# Altium schematic sheet Microcontroller.SchDoc
size A3; ApprovedBy: Betül Demirhan; CheckedBy: UDEMY; DrawnBy: Furkan Demirhan; Revision: AA; SheetNumber: 4; SheetTotal: 5; ProjectDescription: Microcontroller of Wireless Security Detector; ReleaseDate: 21.11.2024
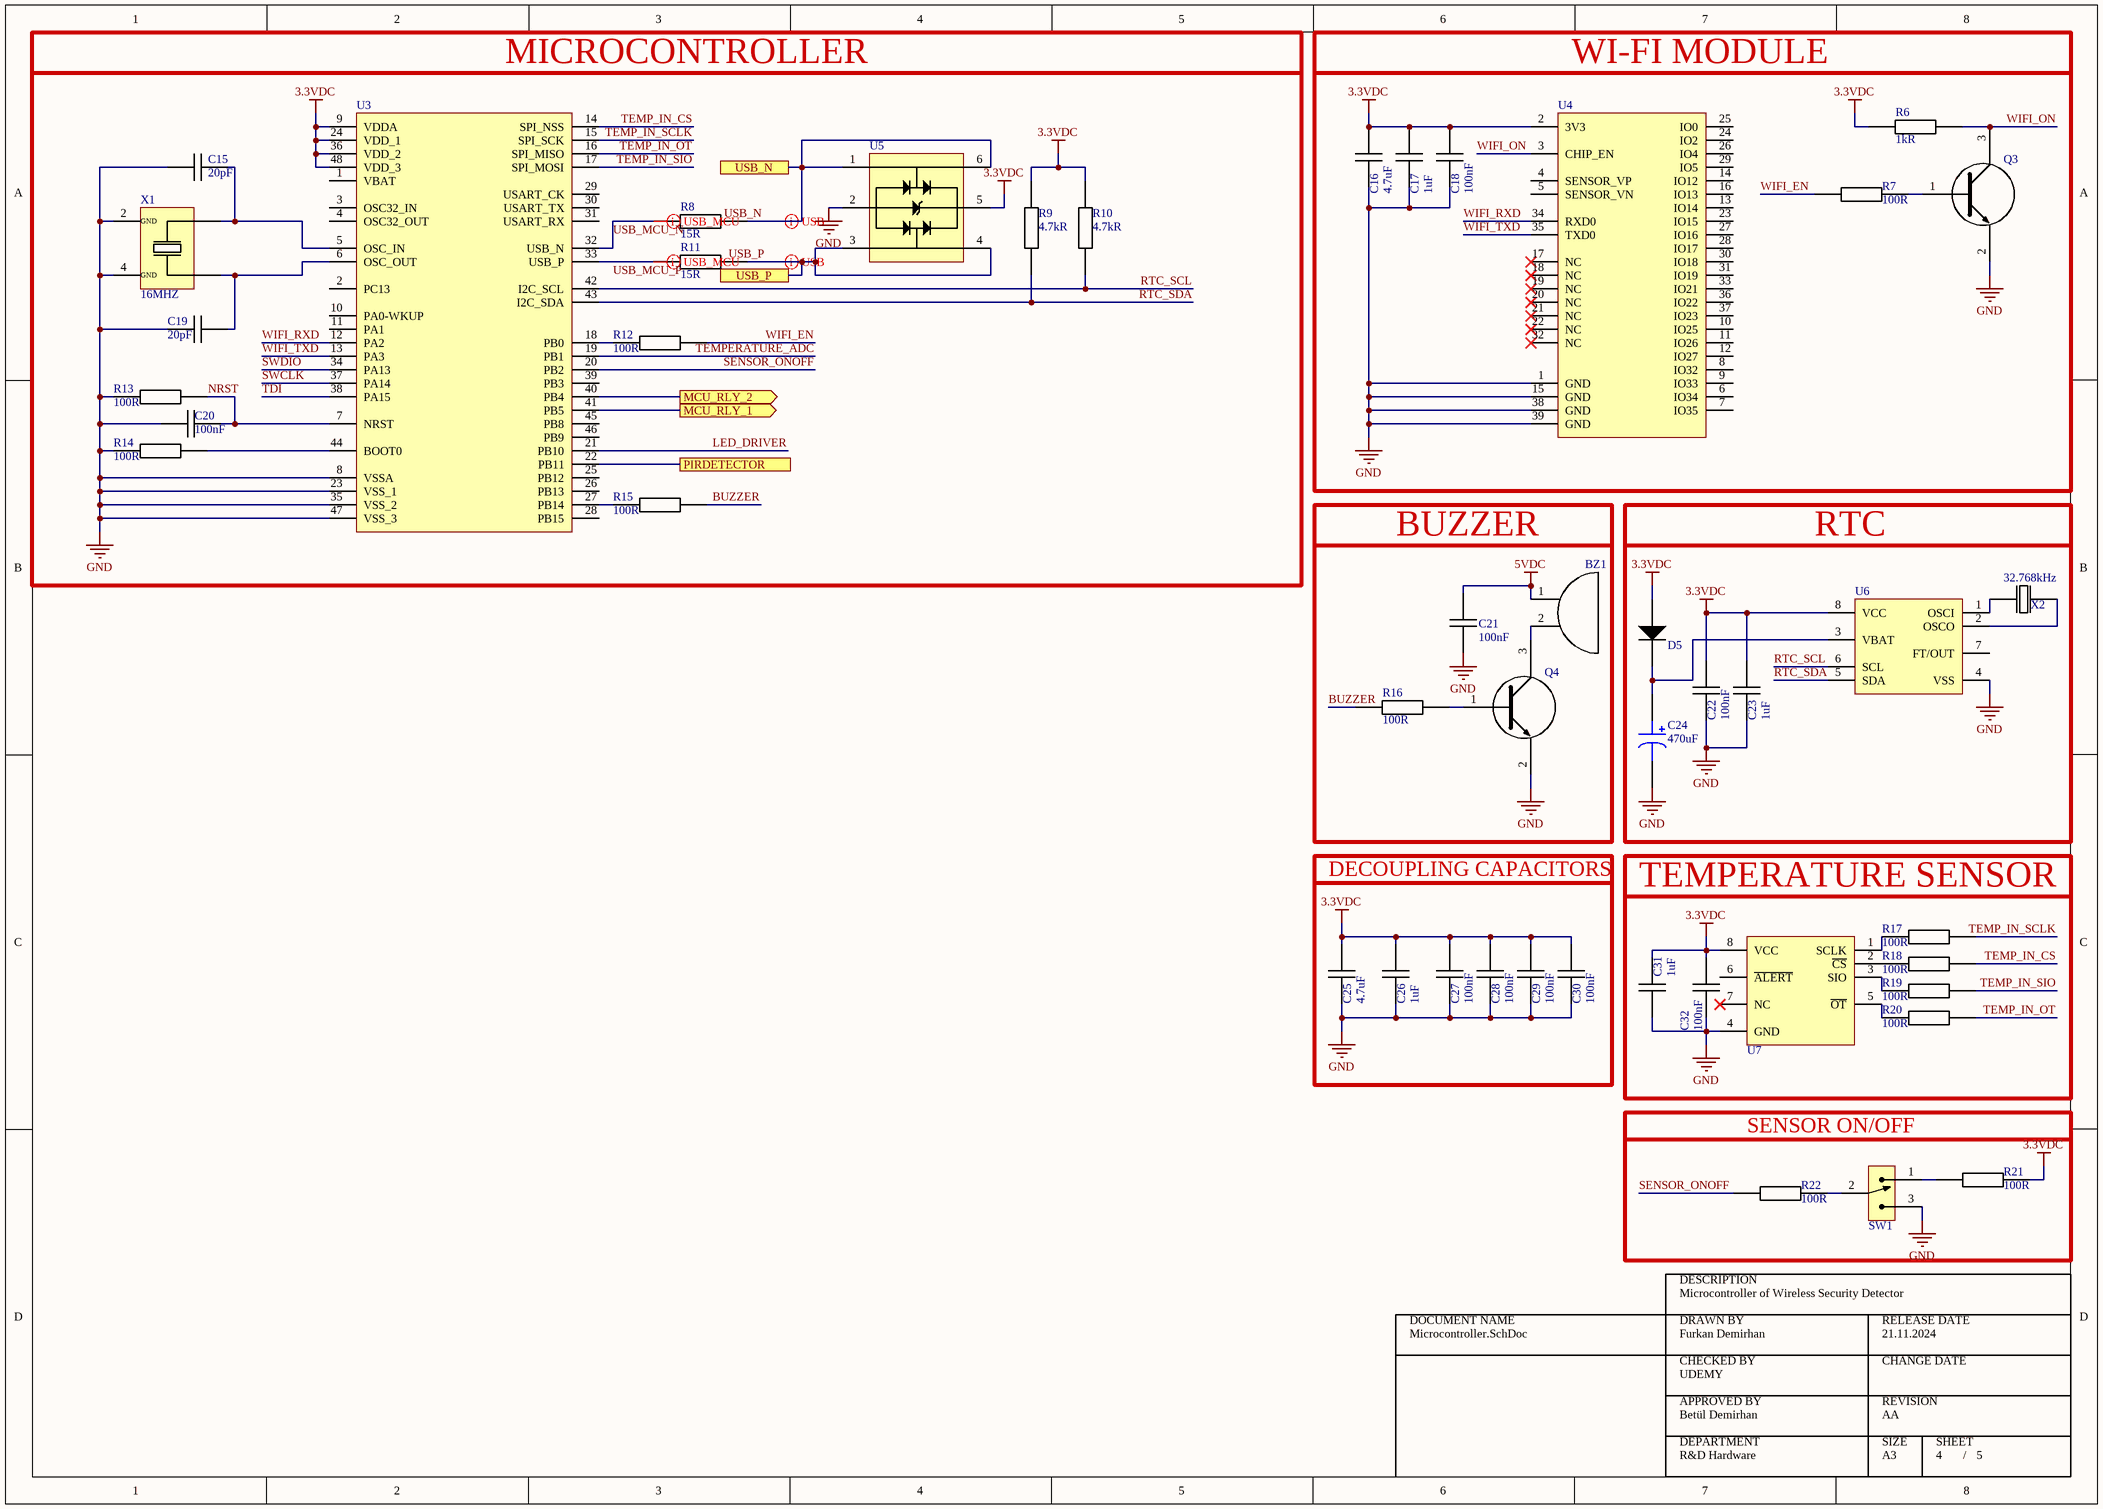
[diagram p0: Microcontroller.SchDoc]

## Parts
BZ1  CMI-9605IC-0580T  [CMI-9605IC-0580T]  (value not drawn)
C15  value 20pF  [CAP_0603]  (hidden comment: CL10C200JB8NNNC)
C16  value 4.7uF  [CAP_0805]  (hidden comment: CL21A475KAQNNNE)
C17  value 1uF  [CAP_0805]  (hidden comment: CL21B105KBFNNNE)
C18  value 100nF  [CAP_0805]  (hidden comment: CL21B104KBCNNNC)
C19  value 20pF  [CAP_0603]  (hidden comment: CL10C200JB8NNNC)
C20  value 100nF  [CAP_0805]  (hidden comment: CL21B104KBCNNNC)
C21  value 100nF  [CAP_0805]  (hidden comment: CL21B104KBCNNNC)
C22  value 100nF  [CAP_0805]  (hidden comment: CL21B104KBCNNNC)
C23  value 1uF  [CAP_0805]  (hidden comment: CL21B105KBFNNNE)
C24  Capacitance: 470uF  [CAP_RADIAL_R10_P5]  (hidden comment: ESH477M050AH4AA)
C25  value 4.7uF  [CAP_0805]  (hidden comment: CL21A475KAQNNNE)
C26  value 1uF  [CAP_0805]  (hidden comment: CL21B105KBFNNNE)
C27  value 100nF  [CAP_0805]  (hidden comment: CL21B104KBCNNNC)
C28  value 100nF  [CAP_0805]  (hidden comment: CL21B104KBCNNNC)
C29  value 100nF  [CAP_0805]  (hidden comment: CL21B104KBCNNNC)
C30  value 100nF  [CAP_0805]  (hidden comment: CL21B104KBCNNNC)
C31  value 1uF  [CAP_0805]  (hidden comment: CL21B105KBFNNNE)
C32  value 100nF  [CAP_0805]  (hidden comment: CL21B104KBCNNNC)
D5  1N4148WS  [SOD323F]  (value not drawn)
Q3  MMBT3904-7-F  [SOT23F]  (value not drawn)
Q4  MMBT3904-7-F  [SOT23F]  (value not drawn)
R6  value 1kR  [RES_0603]  (hidden comment: RC0603FR-071KL)
R7  value 100R  [RES_0603]  (hidden comment: RC0603FR-07100RL)
R8  value 15R  [RES_0603]  (hidden comment: RC0603JR-0715RL)
R9  value 4.7kR  [RES_0603]  (hidden comment: RC0603JR-074K7L)
R10  value 4.7kR  [RES_0603]  (hidden comment: RC0603JR-074K7L)
R11  value 15R  [RES_0603]  (hidden comment: RC0603JR-0715RL)
R12  value 100R  [RES_0603]  (hidden comment: RC0603FR-07100RL)
R13  value 100R  [RES_0603]  (hidden comment: RC0603FR-07100RL)
R14  value 100R  [RES_0603]  (hidden comment: RC0603FR-07100RL)
R15  value 100R  [RES_0603]  (hidden comment: RC0603FR-07100RL)
R16  value 100R  [RES_0603]  (hidden comment: RC0603FR-07100RL)
R17  value 100R  [RES_0603]  (hidden comment: RC0603FR-07100RL)
R18  value 100R  [RES_0603]  (hidden comment: RC0603FR-07100RL)
R19  value 100R  [RES_0603]  (hidden comment: RC0603FR-07100RL)
R20  value 100R  [RES_0603]  (hidden comment: RC0603FR-07100RL)
R21  value 100R  [RES_0603]  (hidden comment: RC0603FR-07100RL)
R22  value 100R  [RES_0603]  (hidden comment: RC0603FR-07100RL)
SW1  EG1215AA  [EG1215AA]  (value not drawn)
U3  STM32F103C6T6A  [LQFP48]  (value not drawn)
U4  ESP32-WROOM-32E-N4  [ESP32-WROOM-32E-N4]  (value not drawn)
U5  USBLC6-2SC6  [SOT23-6L]  (value not drawn)
U6  M41T00M6F  [SOIC8]  (value not drawn)
U7  MAX6662MSA+  [SOIC8]  (value not drawn)
X1  Frequency: 16MHZ  [ECS]  (hidden comment: ECS-160-20-30B-TR)
X2  Frequency: 32.768kHz  [ABS05]  (hidden comment: ABS05-32.768KHZ-T)

## Ports
MCU_RLY_1 (out, see Power Management[6A]), MCU_RLY_2 (out, see Power Management[6B]), PIRDETECTOR (see Power Management[3B]), USB_N (see Power Management[5B]), USB_P (see Power Management[5B])

## Nets
3.3VDC: C16.1 C17.1 C18.1 C22.2 C23.2 C25.2 C26.2 C27.2 C28.2 C29.2 C30.2 C31.2 C32.2 D5.2 R6.1 R9.2 R10.2 R21.2 U3.9(VDDA) U3.24(VDD_1) U3.36(VDD_2) U3.48(VDD_3) U4.2(3V3) U5.5(VBUS) U6.8(VCC) U7.8(VCC)
5VDC: BZ1.1 C21.2
GND: C15.1 C16.2 C17.2 C18.2 C19.1 C20.2 C21.1 C22.1 C23.1 C24.2 C25.1 C26.1 C27.1 C28.1 C29.1 C30.1 C31.1 C32.1 Q3.2(E) Q4.2(E) R13.1 R14.1 SW1.3 U3.8(VSSA) U3.23(VSS_1) U3.35(VSS_2) U3.47(VSS_3) U4.1(GND) U4.15(GND) U4.38(GND) U4.39(GND) U5.2(GND) U6.4(VSS) U7.4(GND) X1.2(GND) X1.4(GND)
BUZZER: R15.2 R16.1
LED_DRIVER: U3.21(PB10)
MCU_RLY_1: U3.41(PB5) ; port MCU_RLY_1
MCU_RLY_2: U3.40(PB4) ; port MCU_RLY_2
NRST: C20.1 R13.2 U3.7(NRST)
PIRDETECTOR: U3.22(PB11) ; port PIRDETECTOR
RTC_SCL: R10.1 U3.42(I2C_SCL) U6.6(SCL)
RTC_SDA: R9.1 U3.43(I2C_SDA) U6.5(SDA)
SENSOR_ONOFF: R22.1 U3.20(PB2)
SWCLK: U3.37(PA14)
SWDIO: U3.34(PA13)
TDI: U3.38(PA15)
TEMP_IN_CS: R18.2 U3.14(SPI_NSS)
TEMP_IN_OT: R20.2 U3.16(SPI_MISO)
TEMP_IN_SCLK: R17.2 U3.15(SPI_SCK)
TEMP_IN_SIO: R19.2 U3.17(SPI_MOSI)
TEMPERATURE_ADC: U3.19(PB1)
USB_MCU_N: R8.1 U3.32(USB_N)
USB_MCU_P: R11.1 U3.33(USB_P)
USB_N: R8.2 U5.1(I/O1) U5.6(I/O1) ; port USB_N
USB_P: R11.2 U5.3(I/O2) U5.4(I/O2) ; port USB_P
WIFI_EN: R7.1 R12.2
WIFI_ON: Q3.3(C) R6.2 U4.3(CHIP_EN)
WIFI_RXD: U3.12(PA2) U4.34(RXD0)
WIFI_TXD: U3.13(PA3) U4.35(TXD0)
NetBZ1_2: BZ1.2 Q4.3(C)
NetC15_2: C15.2 U3.5(OSC_IN) X1.1
NetC19_2: C19.2 U3.6(OSC_OUT) X1.3
NetC24_1: C24.1 D5.1 U6.3(VBAT)
NetQ3_1: Q3.1(B) R7.2
NetQ4_1: Q4.1(B) R16.2
NetR12_1: R12.1 U3.18(PB0)
NetR14_2: R14.2 U3.44(BOOT0)
NetR15_1: R15.1 U3.27(PB14)
NetR17_1: R17.1 U7.1(SCLK)
NetR18_1: R18.1 U7.2(~{CS})
NetR19_1: R19.1 U7.3(SIO)
NetR20_1: R20.1 U7.5(~{OT})
NetR21_1: R21.1 SW1.1
NetR22_2: R22.2 SW1.2
NetU6_1: U6.1(OSCI) X2.1
NetU6_2: U6.2(OSCO) X2.2

Not connected (* = marked no-connect by the designer): U3 1(VBAT) 2(PC13) 3(OSC32_IN) 4(OSC32_OUT) 10(PA0-WKUP) 11(PA1) 25(PB12) 26(PB13) 28(PB15) 29(USART_CK) 30(USART_TX) 31(USART_RX) 39(PB3) 45(PB8) 46(PB9); U4 4(SENSOR_VP) 5(SENSOR_VN) 6(IO34) 7(IO35) 8(IO32) 9(IO33) 10(IO25) 11(IO26) 12(IO27) 13(IO14) 14(IO12) 16(IO13) 17(NC)* 18(NC)* 19(NC)* 20(NC)* 21(NC)* 22(NC)* 23(IO15) 24(IO2) 25(IO0) 26(IO4) 27(IO16) 28(IO17) 29(IO5) 30(IO18) 31(IO19) 32(NC)* 33(IO21) 36(IO22) 37(IO23); U6 7(FT/OUT); U7 6(~{ALERT}) 7(NC)*

## Layout directives
differential pair: USB_MCU_N, USB_MCU_P, USB_N, USB_P

## Notes on the sheet
- MICROCONTROLLER
- WI-FI MODULE
- BUZZER
- RTC
- DECOUPLING CAPACITORS
- TEMPERATURE SENSOR
- SENSOR ON/OFF
- DOCUMENT NAME
- DESCRIPTION
- DRAWN BY
- RELEASE DATE
- CHECKED BY
- CHANGE DATE
- APPROVED BY
- DEPARTMENT
- R&D Hardware
- SIZE
- A3
- REVISION
- SHEET
- /

## Library data of the parts
BZ1 = CMI-9605IC-0580T: Audio Buzzer Magnetic 3VDC 7VDC 30mA 5VDC 85dB 2600Hz to 2800Hz Through Hole Pin Box; Manufacturer: CUI Devices; Designed by: FURKAN; Shape: 4456Shape; Supplier: Digikey; Supplier Part Number: 2223-CMI-9605IC-0580T-ND; Manufacturer Part Number: CMI-9605IC-0580T; RoHS: No; Category: Audio Products; Stock: 4371; Pricing: 1=1,15, 10=0,937, 25=0,8636, 50=0,8122, 150=0,737, 300=0,73127 (USD); Length: 9.6mm; Width: 9.6mm; Height: 5mm; Case/Package: CMI-9605IC-0580T
C15 C19 = CAP CER 20pF 0603: CAP CER 20pF ±5% 0603 SMD; Manufacturer: Samsung; Designed by: FURKAN; Voltage Rating (DC): 50V; Supplier: Digikey; Supplier Part Number: 1276-1187-1-ND; Manufacturer Part Number: CL10C200JB8NNNC; RoHS: Yes; Category: Ceramic Capacitors; Stock: 252087; Pricing: 1=0,1, 10=0,035, 50=0,0236, 100=0,0201, 500=0,01432, 1000=0,01254 (USD); ComponentLink1URL: https://datasheet.ciiva.com/26877/getdatasheetpartid-640634-26877974.pdf?src-supplier=Verical; ComponentLink1Description: https://datasheet.ciiva.com/26877/getdatasheetpartid-640634-26877974.pdf?src-supplier=Verical; ComponentLink2URL: https://datasheet.ciiva.com/26310/mlcc-catalogdownload2013-eng-26310315.pdf?src-supplier=Distrelec; ComponentLink2Description: https://datasheet.ciiva.com/26310/mlcc-catalogdownload2013-eng-26310315.pdf?src-supplier=Distrelec; Case/Package: 0603
C16 C25 = CAP CER 4.7uF 0805: Multilayer Ceramic Capacitor, 4.7 uF, 25 V, ± 10%, X5R, 0805 [2012 Metric]; Manufacturer: Samsung; Designed by: FURKAN; Voltage Rating: 25V; ComponentLink1URL: https://datasheet.ciiva.com/25798/cl21a475kaqnnne-25798882.pdf?src-supplier=Digikey; ComponentLink1Description: https://datasheet.ciiva.com/25798/cl21a475kaqnnne-25798882.pdf?src-supplier=Digikey; Supplier: Digikey; Supplier Part Number: 1276-1244-1-ND; Manufacturer Part Number: CL21A475KAQNNNE; RoHS: Yes; Category: Ceramic Capacitors; Stock: 2972760; Pricing: 1=0,1, 10=0,057, 50=0,0394, 100=0,0339, 500=0,02466, 1000=0,02177 (USD); Mounting Technology: Surface Mount; Case/Package: 0805; Case Code (Metric): 2012; Case Code (Imperial): 0805; Material: Ceramic; Min Operating Temperature: -55°C; Max Operating Temperature: 85°C; Packaging: Tape and Reel; Tolerance: 10%; Dielectric: X5R; Voltage Rating (DC): 25V; Series: CL; Construction: Flat; Length: 2mm; Height: 1.25mm; Depth: 1.25mm; Radiation Hardening: No; Lead Free: Lead Free; RoHS Compliant: Yes
C17 C23 C26 C31 = CAP CER 1uF 0805: Multilayer Ceramic Capacitor, 1 uF, 50 V, 10%, X7R, 0805 [2012 Metric]; Manufacturer: Samsung; Voltage Rating: 50V; Designed by: FURKAN; Supplier: Digikey; Supplier Part Number: 1276-1029-1-ND; Manufacturer Part Number: CL21B105KBFNNNE; RoHS: Yes; Category: Ceramic Capacitors; Stock: 845645; Pricing: 1=0,11, 10=0,061, 50=0,042, 100=0,0361, 500=0,02632, 1000=0,02327, 2000=0,02075, 4000=0,01867, 6000=0,01762, 10000=0,01646, 14000=0,01578, 20000=0,01512, 50000=0,0137, 100000=0,01283, 200000=0,01212 (USD); Mounting Technology: Surface Mount; Case/Package: 0805; Case Code (Metric): 2012; Case Code (Imperial): 0805; Material: Ceramic; Min Operating Temperature: -55°C; Max Operating Temperature: 125°C; Tolerance: 10%; Packaging: Tape and Reel; Package Quantity: 1; Dielectric: X7R; Voltage: 50V; Series: CL; Construction: Flat; Voltage Rating (DC): 50V; Length: 2mm; Width: 0.049inch; Height: 1.25mm; Thickness: 0.053inch; Depth: 1.25mm; Radiation Hardening: No; RoHS Compliant: Yes; ComponentLink1URL: https://datasheet.ciiva.com/25800/cl21b105kbfnnne-25800291.pdf?src-supplier=Digikey; ComponentLink1Description: https://datasheet.ciiva.com/25800/cl21b105kbfnnne-25800291.pdf?src-supplier=Digikey; ComponentLink2URL: https://datasheet.ciiva.com/16449/cl21b105kbfnnne-16449003.pdf?src-supplier=Future+Electronics; ComponentLink2Description: https://datasheet.ciiva.com/16449/cl21b105kbfnnne-16449003.pdf?src-supplier=Future+Electronics; ComponentLink3URL: https://datasheet.ciiva.com/26838/getdatasheetpartid-354075-26838668.pdf?src-supplier=Verical; ComponentLink3Description: https://datasheet.ciiva.com/26838/getdatasheetpartid-354075-26838668.pdf?src-supplier=Verical
C18 C20-C22 C27-C30 C32 = CAP CER 100nF 0805: CAP CER 100 nF 10% 50 V 0805 SMD; Manufacturer: Samsung; Designed by: FURKAN; Material: Ceramic; Dielectric: X7R; Voltage Rating: 50V; Supplier: Digikey; Supplier Part Number: 1276-1003-1-ND; Manufacturer Part Number: CL21B104KBCNNNC; RoHS: Yes; Category: Ceramic Capacitors; Stock: 2055733; Pricing: 1=0,1, 10=0,035, 50=0,0238, 100=0,0203, 500=0,01446, 1000=0,01266, 4000=0,00995, 8000=0,00893, 12000=0,00842, 20000=0,00785, 28000=0,00752, 40000=0,0072, 100000=0,00651, 200000=0,00609, 400000=0,00574 (USD); Mounting Technology: Surface Mount; Case/Package: 0805; Case Code (Metric): 2012; Case Code (Imperial): 0805; Min Operating Temperature: -55°C; Max Operating Temperature: 125°C; Tolerance: 10%; Packaging: Tape and Reel; Voltage: 50V; Series: CL; Construction: Flat; Voltage Rating (DC): 50V; Length: 2mm; Width: 0.049inch; Height: 0.85mm; Depth: 1.25mm; Thickness: 0.037inch; Radiation Hardening: No; RoHS Compliant: Yes; Lead Free: 5697LeadFree; ComponentLink1URL: https://datasheet.ciiva.com/25710/cl21b104kbcnnnc-25710182.pdf?src-supplier=Digikey; ComponentLink1Description: https://datasheet.ciiva.com/25710/cl21b104kbcnnnc-25710182.pdf?src-supplier=Digikey; ComponentLink2URL: https://datasheet.ciiva.com/29199/454152-da-01-en-vs-kondensator-0805-29199814.pdf?src-supplier=Conrad; ComponentLink2Description: https://datasheet.ciiva.com/29199/454152-da-01-en-vs-kondensator-0805-29199814.pdf?src-supplier=Conrad
C24 = CAP ALU ELEC 470uF: Electrolytic capacitor, 470 µF, 50 V (DC), ±20 %, radial, pitch 5 mm, Ø 13 mm; Manufacturer: KEMET; Designed by: FURKAN; Voltage Rating (DC): 50V; Category: LDO; Diameter: 10mm; Height: 20mm; Manufacturer Part Number: ESH477M050AH4AA; Supplier: Digikey; Supplier Part Number: 399-15683-ND; RoHS: Yes; Stock: 39; Pricing: 1=0,69, 10=0,417, 50=0,3084, 200=0,2466, 600=0,21183, 1000=0,1989, 2600=0,17907, 5000=0,16818 (USD); ComponentLink1URL: https://api.kemet.com/component-edge/download/datasheet/ESH477M050AH4AA.pdf?src-supplier=Digikey; ComponentLink1Description: https://api.kemet.com/component-edge/download/datasheet/ESH477M050AH4AA.pdf?src-supplier=Digikey; ComponentLink2URL: https://datasheet.octopart.com/ESH477M050AH4AA-KEMET-datasheet-130075338.pdf?src-supplier=Newark; ComponentLink2Description: https://datasheet.octopart.com/ESH477M050AH4AA-KEMET-datasheet-130075338.pdf?src-supplier=Newark; Case/Package: CAP_RADIAL_R10_P5
D5 = 1N4148WS: Diode Ultra Fast Recovery Rectifier 75V 0.15A 2-Pin SOD-323F T/R; Manufacturer: ON Semiconductor / Fairchild; Designed by: FURKAN; Max Reverse Current: 5uA; Max Forward Surge Current (Ifsm): 2A; Forward Current: 150mA; Reverse Recovery Time: 4ns; Element Configuration: Single; Value: 4pF; Supplier: Digikey; Supplier Part Number: 1N4148WSFSCT-ND; Manufacturer Part Number: 1N4148WS; RoHS: Yes; Category: Rectifier Diodes; Stock: 255722; Pricing: 1=0,11, 10=0,076, 100=0,051, 500=0,0387, 1000=0,0345, 3000=0,02897, 6000=0,02611, 9000=0,02463, 15000=0,02296, 21000=0,02195, 30000=0,02097, 75000=0,0188, 150000=0,01745, 300000=0,0165 (USD); Mounting Technology: Surface Mount; Pins: 2; Weight: 0.0276g; Min Operating Temperature: -55°C; Max Operating Temperature: 150°C; Average Rectified Current: 150mA; Max Repetitive Reverse Voltage (Vrrm): 75V; Reverse Voltage: 75V; Max Reverse Voltage (DC): 75V; Series: -; Packaging: Tape and Reel; Package Quantity: 1; Recovery Time: 4ns; Length: 1.8mm; Width: 1.35mm; Height: 1mm; Radiation Hardening: No; RoHS Compliant: Yes; Reach SVHC Compliant: No; Lead Free: 5697LeadFree; ComponentLink1URL: https://datasheet.ciiva.com/15208/getdatasheetpartid-127819-15208358.pdf?src-supplier=Verical; ComponentLink1Description: https://datasheet.ciiva.com/15208/getdatasheetpartid-127819-15208358.pdf?src-supplier=Verical; ComponentLink2URL: https://datasheet.ciiva.com/8300/1n914bws-8300360.pdf?src-supplier=Avnet; ComponentLink2Description: https://datasheet.ciiva.com/8300/1n914bws-8300360.pdf?src-supplier=Avnet; ComponentLink3URL: https://datasheet.ciiva.com/910/1n4148ws-910381.pdf?src-supplier=Digikey; ComponentLink3Description: https://datasheet.ciiva.com/910/1n4148ws-910381.pdf?src-supplier=Digikey; Case/Package: SOD323F
Q3 Q4 = MMBT3904-7-F: Transistor General Purpose BJT NPN 40 Volt 0.2A Automotive 3-Pin SOT-23; Manufacturer: Diodes Zetex; Designed by: FURKAN; Max Power Dissipation: 300mW; Collector Emitter Voltage (VCEO): 40V; Max Collector Current: 200mA; Collector Base Voltage (VCBO): 60V; Power Dissipation: 350mW; Frequency: 300MHz; hFE Min: 100; Number of Elements: 1; Emitter Base Voltage (VEBO): 6V; Collector Emitter Saturation Voltage: 300mV; Supplier: Digikey; Supplier Part Number: MMBT3904-FDICT-ND; Manufacturer Part Number: MMBT3904-7-F; RoHS: Yes; Category: BJTs; Stock: 3904155; Pricing: 1=0,1, 10=0,054, 100=0,0361, 500=0,0273, 1000=0,02428, 3000=0,02028, 6000=0,0182, 9000=0,01712, 15000=0,01589, 21000=0,01516, 30000=0,01444, 75000=0,01285, 150000=0,01185, 300000=0,01101 (USD); Mounting Technology: Surface Mount; Case/Package: SOT-23; Pins: 3; Weight: 0.000282oz; Min Operating Temperature: -55°C; Max Operating Temperature: 150°C; Polarity: NPN; Packaging: Tape and Reel; Voltage Rating (DC): 40V; Package Quantity: 3000; Transition Frequency: 300MHz; Collector Emitter Breakdown Voltage: 40V; Max Breakdown Voltage: 40V; Continuous Collector Current: 200mA; Clock Frequency: 300MHz; Gain Bandwidth Product: 300MHz; Series: Automotive, AEC-Q101; Collector-emitter Voltage-Max: 300mV; Length: 3.05mm; Width: 1.4mm; Height: 1mm; Radiation Hardening: No; Reach SVHC Compliant: No; Lead Free: Lead Free; RoHS Compliant: Yes; ComponentLink1URL: https://datasheet.ciiva.com/11201/ds30036-11201778.pdf?src-supplier=Avnet; ComponentLink1Description: https://datasheet.ciiva.com/11201/ds30036-11201778.pdf?src-supplier=Avnet; ComponentLink2URL: https://datasheet.ciiva.com/15138/getdatasheetpartid-53265-15138780.pdf?src-supplier=Verical; ComponentLink2Description: https://datasheet.ciiva.com/15138/getdatasheetpartid-53265-15138780.pdf?src-supplier=Verical; ComponentLink3URL: https://datasheet.ciiva.com/22711/1915516-22711750.pdf?src-supplier=Element14; ComponentLink3Description: https://datasheet.ciiva.com/22711/1915516-22711750.pdf?src-supplier=Element14; ComponentLink4URL: https://datasheet.ciiva.com/11198/ds30036-11198999.pdf?src-supplier=Avnet; ComponentLink4Description: https://datasheet.ciiva.com/11198/ds30036-11198999.pdf?src-supplier=Avnet; ComponentLink5URL: https://datasheet.ciiva.com/6361/ds30036-6361256.pdf?src-supplier=Digikey; ComponentLink5Description: https://datasheet.ciiva.com/6361/ds30036-6361256.pdf?src-supplier=Digikey; ComponentLink6URL: https://datasheet.ciiva.com/6361/ds30036-6361254.pdf?src-supplier=Digikey; ComponentLink6Description: https://datasheet.ciiva.com/6361/ds30036-6361254.pdf?src-supplier=Digikey
R6 = RES 1K OHM 0603: RES 1K OHM 1% 0603 SMD; Manufacturer: Yageo; Designed by: FURKAN; Temperature Coefficient: 100ppm/°C; Power Rating: 100mW; Voltage Rating: 50V; Supplier: Digikey; Supplier Part Number: 311-1.00KHRCT-ND; Manufacturer Part Number: RC0603FR-071KL; RoHS: Yes; Category: Chip SMD Resistors; Stock: 6043157; Pricing: 1=0,1, 10=0,012, 50=0,0096, 100=0,0071, 500=0,00612, 1000=0,0051, 5000=0,0051, 10000=0,00221, 15000=0,00204, 25000=0,0019 (USD); Case/Package: 0603; Contact Plating: Tin,Matte; Case Code (Imperial): 0603; Case Code (Metric): 1608; Min Operating Temperature: -55°C; Max Operating Temperature: 155°C; Tolerance: 1%; Resistor Type: Thick Film; Packaging: Tape and Reel; Termination: SMD/SMT; Features: Moisture Resistant; Series: RC; Max Power Dissipation: 100mW; Number of Terminations: 2; Technology: THICK FILM; Resistance Tolerance: 1%; Construction: Rectangular; Length: 1.6mm; Height: 0.45mm; Depth: 0.8mm; Reach SVHC Compliant: No; Lead Free: 5697LeadFree; Military Standard: Not; RoHS Compliant: Yes
R7 R12-R22 = RES 100 OHM 0603: RES 100 OHM 1% 0603 SMD; Manufacturer: Yageo; Designed by: FURKAN; Temperature Coefficient: 100ppm/°C; Voltage Rating (DC): 50V; Power Rating: 100mW; Supplier: Digikey; Supplier Part Number: 311-100HRCT-ND; Manufacturer Part Number: RC0603FR-07100RL; RoHS: Yes; Category: Chip SMD Resistors; Stock: 1340836; Pricing: 1=0,1, 10=0,012, 50=0,0096, 100=0,0071, 500=0,00612, 1000=0,0051 (USD); Case/Package: 0603; Pins: 2; Case Code (Imperial): 0603; Case Code (Metric): 1608; Min Operating Temperature: -55°C; Max Operating Temperature: 155°C; Tolerance: 1%; Resistor Type: Thick Film; Packaging: Tape and Reel; Voltage Rating: 50V; Termination: SMD/SMT; Features: Moisture Resistant; Series: RC; Max Power Dissipation: 100mW; Number of Terminations: 2; Construction: Rectangular; Resistance Tolerance: 1%; Technology: THICK FILM; Length: 1.6mm; Width: 0.8mm; Height: 0.45mm; Depth: 0.8mm; Lead Free: Lead Free; Reach SVHC Compliant: Unknown; RoHS Compliant: Yes; Military Standard: Not
R8 R11 = RES 15 OHM 0603: RES 15 OHM 5% 0603 SMD; Manufacturer: Yageo; Designed by: FURKAN; Voltage Rating (AC): 50V; Supplier: Digikey; Supplier Part Number: 311-15GRCT-ND; Manufacturer Part Number: RC0603JR-0715RL; RoHS: Yes; Category: Chip SMD Resistors; Stock: 96624; Pricing: 1=0,1, 10=0,01, 50=0,0082, 100=0,0061, 500=0,0051, 1000=0,00408, 5000=0,00204, 10000=0,00133 (USD); Lead Free: 5697LeadFree; ComponentLink1URL: https://datasheet.ciiva.com/2453/pyu-r-int-thick-7-2453085.pdf?src-supplier=Digikey; ComponentLink1Description: https://datasheet.ciiva.com/2453/pyu-r-int-thick-7-2453085.pdf?src-supplier=Digikey; ComponentLink2URL: https://datasheet.ciiva.com/2453/pyu-r-int-thick-7-2453086.pdf?src-supplier=Digikey; ComponentLink2Description: https://datasheet.ciiva.com/2453/pyu-r-int-thick-7-2453086.pdf?src-supplier=Digikey; ComponentLink3URL: https://datasheet.ciiva.com/2453/pyu-r-int-thick-7-2453087.pdf?src-supplier=Digikey; ComponentLink3Description: https://datasheet.ciiva.com/2453/pyu-r-int-thick-7-2453087.pdf?src-supplier=Digikey; ComponentLink4URL: https://datasheet.ciiva.com/7746/443971-7746445.pdf?src-supplier=Element14; ComponentLink4Description: https://datasheet.ciiva.com/7746/443971-7746445.pdf?src-supplier=Element14; ComponentLink5URL: https://datasheet.ciiva.com/7746/443971-7746446.pdf?src-supplier=Element14; ComponentLink5Description: https://datasheet.ciiva.com/7746/443971-7746446.pdf?src-supplier=Element14; Case/Package: 0603
R9 R10 = RES 4.7K OHM 0603: RES 4.7K OHM 5% 0603 SMD; Manufacturer: Yageo; Designed by: FURKAN; Voltage Rating (DC): 50V; Temperature Coefficient: 100ppm/°C; Power Rating: 100mW; Supplier: Digikey; Supplier Part Number: 311-4.7KGRCT-ND; Manufacturer Part Number: RC0603JR-074K7L; RoHS: Yes; Category: Chip SMD Resistors; Stock: 4168796; Pricing: 1=0,1, 10=0,01, 50=0,0082, 100=0,0061, 500=0,0056, 1000=0,0051 (USD); Case/Package: 0603; Pins: 2; Case Code (Imperial): 0603; Case Code (Metric): 1608; Min Operating Temperature: -55°C; Max Operating Temperature: 155°C; Resistor Type: Thick Film; Tolerance: 5%; Voltage Rating: 50V; Packaging: Tape and Reel; Termination: SMD/SMT; Features: Moisture Resistant; Max Power Dissipation: 100mW; Number of Terminations: 2; Series: RC; Resistance Tolerance: 5%; Construction: Rectangular; Voltage Rating (AC): 50V; Length: 1.6mm; Width: 0.8mm; Depth: 0.8mm; Reach SVHC Compliant: No; RoHS Compliant: Yes; Lead Free: 5697LeadFree; Military Standard: Not; ComponentLink1URL: https://datasheet.ciiva.com/46412/443971-46412858.pdf?src-supplier=Element14; ComponentLink1Description: https://datasheet.ciiva.com/46412/443971-46412858.pdf?src-supplier=Element14
SW1 = EG1215AA: Slide Switch, SPDT, 0.025A, 24V, SMD; Manufacturer: E-Switch; Designed by: FURKAN; Mechanical Life: 10000Cycles; Switch Function: On-On; Actuator Type: Standard; Switch Travel: 1.5mm; Operating Force: 150gf; Actuator Length: 1.4mm; Supplier: Digikey; Supplier Part Number: EG5720CT-ND; Manufacturer Part Number: EG1215AA; RoHS: Yes; Stock: 19211; Pricing: 1=1,13, 10=0,918, 25=0,8444, 100=0,7436, 250=0,68272, 500=0,63956, 1000=0,59868, 2500=0,54794, 5000=0,5119, 7500=0,4917, 12500=0,46714, 17500=0,4525 (USD); Mounting Technology: Surface Mount; Min Operating Temperature: -20°C; Max Operating Temperature: 70°C; Throw Configuration: SPDT; Packaging: Cut Tape; Voltage Rating (DC): 24V; Termination: Gull Wing; Electrical Life: 10000Cycles; Series: EG; RoHS Compliant: Yes; ComponentLink1URL: https://media.digikey.com/pdf/Data%20Sheets/E-Switch%20PDFs/EG1215_Series_Ds.pdf?src-supplier=Digikey; ComponentLink1Description: https://media.digikey.com/pdf/Data%20Sheets/E-Switch%20PDFs/EG1215_Series_Ds.pdf?src-supplier=Digikey; ComponentLink2URL: http://www.farnell.com/datasheets/2645007.pdf?src-supplier=Farnell; ComponentLink2Description: http://www.farnell.com/datasheets/2645007.pdf?src-supplier=Farnell; Case/Package: EG1215AA
U3 = STM32F103C6T6A: MCU 32-bit STM32F ARM Cortex M3 RISC 32KB Flash 2.5V/3.3V 48-Pin LQFP Tray; Manufacturer: STMicroelectronics; Number of Timers/Counters: 3; Max Supply Voltage: 3.6V; Interface: I2C,SPI,USART; RAM Size: 10KB; Number of I/Os: 37; Min Supply Voltage: 2V; Data Bus Width: 32b; Clock Frequency: 72MHz; Number of ADC Channels: 10; Designed by: FURKAN; SleepMode: OK; Supplier: Digikey; RoHS: Yes; Category: Microcontrollers; Stock: 832; Pricing: 1=6,07, 10=5,453, 25=5,1552, 80=4,46775, 250=4,23868, 500=3,80336, 1000=3,20766, 2500=3,04728 (USD); Case/Package: LQFP; Pins: 48; Weight: 0.006409oz; Min Operating Temperature: -40°C; Max Operating Temperature: 85°C; Packaging: Tray; Series: STM32F103C6; Package Quantity: 1500; Memory Format: FLASH; Memory Size: 32KB; Core Architecture: ARM; Length: 7mm; Width: 7mm; Height: 1.4mm; Lead Free: Lead Free; RoHS Compliant: Yes; ComponentLink1URL: https://datasheet.ciiva.com/15122/getdatasheetpartid-69879-15122075.pdf?src-supplier=Verical; ComponentLink1Description: https://datasheet.ciiva.com/15122/getdatasheetpartid-69879-15122075.pdf?src-supplier=Verical; ComponentLink2URL: https://datasheet.ciiva.com/14100/pustm-arm-microcont-stm32f103-en-14100507.pdf?src-supplier=Distrelec; ComponentLink2Description: https://datasheet.ciiva.com/14100/pustm-arm-microcont-stm32f103-en-14100507.pdf?src-supplier=Distrelec; Supplier Part Number: 497-11515-ND; Manufacturer Part Number: STM32F103C6T6A
U4 = ESP32-WROOM-32E-N4: SMD module, ESP32-D0WD-V3, ESP32 ECO V3, 4 MB SPI flash, PCB antenna; Manufacturer: Espressif Systems; Manufacturer Part Number: ESP32-WROOM-32E(M113EH3200PH3Q0); Designed by: FURKAN; Interface: 39,40,1515,1518,1532Interface; Bandwidth: 72MHz; Data Rate: 150Mbps; Clock Frequency: 2.484GHz; Max Supply Voltage: 3.6V; Min Supply Voltage: 3V; Nominal Supply Current: 500mA; Number of ADC Channels: 16NUMBER; Number of GPIO: 26NUMBER; Supplier: Digikey; Supplier Part Number: 1965-ESP32-WROOM-32E-N4TR-ND; RoHS: No; Category: RF Receivers, Transceivers; Pricing: 650=2,5 (USD); Min Operating Temperature: -40°C; Max Operating Temperature: 85°C; Height: 3.25mm; ComponentLink1Description: Datasheet; ComponentLink1URL: https://www.digikey.com/en/products/detail/espressif-systems/esp32-wroom-32e-n4/11613125; Case/Package: ESP32-WROOM-32E-N4
U5 = USB PROTECTION: ESD Suppressor Diode Array Dual Uni-Dir 15kV Air Gap/15kV Contact Disc 6-Pin SOT-23 T/R; Manufacturer: STMicroelectronics; Designed by: FURKAN; Direction: Unidirectional,Bidirectional; Value: 3.5pF; Operating Supply Voltage: 1.1V; Number of Channels: 2; Breakdown Voltage: 6V; Clamping Voltage: 17V; Reverse Standoff Voltage: 5.25V; Power Line Protection: Yes; Test Current: 1mA; Max Reverse Leakage Current: 150nA; Peak Pulse Current: 5A; Data Rate: 480Mbps; Number of Elements: 1; Working Voltage: 5V; Supplier: Digikey; Supplier Part Number: 497-5235-1-ND; Manufacturer Part Number: USBLC6-2SC6; RoHS: Yes; Category: TVS Diodes; Stock: 88623; Pricing: 1=0,5, 10=0,305, 100=0,1933, 500=0,14502, 1000=0,12941 (USD); Mounting Technology: Surface Mount; Case/Package: SOT-23; Pins: 6; Min Operating Temperature: -40°C; Max Operating Temperature: 125°C; Packaging: Tape and Reel; Package Quantity: 3000; Termination: SMD/SMT; Number of Bidirectional Channels: 2; Min Breakdown Voltage: 6V; ESD Protection: Yes; Leakage Current: 150nA; Series: USB; Reverse Breakdown Voltage: 6V; Polarity: Unidirectional,Bidirectional; Max Breakdown Voltage: 6V; Clamping Voltage-Max: 17V; Max Repetitive Reverse Voltage (Vrrm): 5.25V; Length: 3.05mm; Width: 1.75mm; Height: 1.3mm; Depth: 1.75mm; Radiation Hardening: No; Lead Free: Lead Free; Reach SVHC Compliant: No; RoHS Compliant: Yes; ComponentLink1URL: https://datasheet.ciiva.com/1268/1690354-1268384.pdf?src-supplier=Element14; ComponentLink1Description: https://datasheet.ciiva.com/1268/1690354-1268384.pdf?src-supplier=Element14; ComponentLink2URL: https://datasheet.ciiva.com/4508/cd00050750-113117-4508433.pdf?src-supplier=Mouser; ComponentLink2Description: https://datasheet.ciiva.com/4508/cd00050750-113117-4508433.pdf?src-supplier=Mouser; ComponentLink3URL: https://datasheet.ciiva.com/15143/getdatasheetpartid-148465-15143789.pdf?src-supplier=Verical; ComponentLink3Description: https://datasheet.ciiva.com/15143/getdatasheetpartid-148465-15143789.pdf?src-supplier=Verical; ComponentLink4URL: https://datasheet.ciiva.com/16200/cd00050750-16200026.pdf?src-supplier=Future+Electronics; ComponentLink4Description: https://datasheet.ciiva.com/16200/cd00050750-16200026.pdf?src-supplier=Future+Electronics; ComponentLink5URL: https://datasheet.ciiva.com/41444/001184109-da-01-en-ic-esd-protecti-usblc6-2sc6-sot-23-6-stm-41444156.pdf?src-supplier=Conrad; ComponentLink5Description: https://datasheet.ciiva.com/41444/001184109-da-01-en-ic-esd-protecti-usblc6-2sc6-sot-23-6-stm-41444156.pdf?src-supplier=Conrad
U6 = M41T00M6F: M41T00 Series 5.5 V I2C / 2-Wire / Serial Surface Mount Real Time Clock - SOIC-8; Manufacturer: STMicroelectronics; Designed by: FURKAN; Memory Size: 8B; Frequency: 100kHz; Nominal Supply Current: 800nA; Number of Outputs: 1NUMBER; Supplier: Digikey; Supplier Part Number: 497-4697-1-ND; Manufacturer Part Number: M41T00M6F; RoHS: Yes; Category: Real Time Clocks; Stock: 17686; Pricing: 1=3,77, 10=3,388, 25=3,2032, 100=2,776, 250=2,63364, 500=2,36316, 1000=1,99303, 2500=1,89338, 5000=1,8222 (USD); RAM Size: 8B; Lead Free: 5697LeadFree; ComponentLink1URL: https://datasheet.ciiva.com/7630/1837112-7630077.pdf?src-supplier=Element14; ComponentLink1Description: https://datasheet.ciiva.com/7630/1837112-7630077.pdf?src-supplier=Element14; ComponentLink2URL: https://datasheet.ciiva.com/16213/cd00001542-16213654.pdf?src-supplier=Future+Electronics; ComponentLink2Description: https://datasheet.ciiva.com/16213/cd00001542-16213654.pdf?src-supplier=Future+Electronics; ComponentLink3URL: https://datasheet.ciiva.com/41459/001185345-da-01-en-ic-rtc-srl-512kbit-m41t00m6f-soic-8-stm-41459818.pdf?src-supplier=Conrad; ComponentLink3Description: https://datasheet.ciiva.com/41459/001185345-da-01-en-ic-rtc-srl-512kbit-m41t00m6f-soic-8-stm-41459818.pdf?src-supplier=Conrad; Number of Pins: 8; Case/Package: SOIC
U7 = MAX6662MSA+: Temp Sensor Digital Serial (3-Wire, SPI) 8-Pin SOIC N Tube; Manufacturer: Maxim; Designed by: FURKAN; Supplier: Digikey; Supplier Part Number: MAX6662MSA+-ND; Manufacturer Part Number: MAX6662MSA+; RoHS: Yes; Category: Temperature and Humidity Sensors; Stock: 485; Pricing: 1=5,39, 5=4,546, 10=4,224, 25=3,8336, 50=3,5624, 100=3,3107, 500=2,79292, 1000=2,59582 (USD); ComponentLink1URL: https://datasheet.ciiva.com/5299/max6662-89142-5299456.pdf?src-supplier=Mouser; ComponentLink1Description: https://datasheet.ciiva.com/5299/max6662-89142-5299456.pdf?src-supplier=Mouser; ComponentLink2URL: https://datasheet.ciiva.com/3277/max6662-3277979.pdf?src-supplier=Avnet; ComponentLink2Description: https://datasheet.ciiva.com/3277/max6662-3277979.pdf?src-supplier=Avnet; ComponentLink3URL: https://datasheet.ciiva.com/2003/max6662-2003390.pdf?src-supplier=Digikey; ComponentLink3Description: https://datasheet.ciiva.com/2003/max6662-2003390.pdf?src-supplier=Digikey; Case/Package: SOIC8
X1 = CRYSTAL 16MHZ: Crystal 16MHz ±30ppm (Tol) ±50ppm (Stability) 20pF FUND 50Ohm 4-Pin Mini-SMD T/R; Manufacturer: ECS International; Designed by: FURKAN; Supplier: Digikey; Supplier Part Number: XC1120CT-ND; Manufacturer Part Number: ECS-160-20-30B-TR; RoHS: Yes; Category: Crystals; Stock: 18467; Pricing: 1=0,66, 10=0,58, 50=0,5182, 100=0,4968, 500=0,4504 (USD); ComponentLink1URL: https://datasheet.ciiva.com/853/ecx-53b-853408.pdf?src-supplier=Digikey; ComponentLink1Description: https://datasheet.ciiva.com/853/ecx-53b-853408.pdf?src-supplier=Digikey; ComponentLink2URL: https://datasheet.ciiva.com/853/ecx-53b-853407.pdf?src-supplier=Digikey; ComponentLink2Description: https://datasheet.ciiva.com/853/ecx-53b-853407.pdf?src-supplier=Digikey; ComponentLink3URL: https://datasheet.ciiva.com/853/ecx-53b-853406.pdf?src-supplier=Digikey; ComponentLink3Description: https://datasheet.ciiva.com/853/ecx-53b-853406.pdf?src-supplier=Digikey; Case/Package: ECS
X2 = CRYSTAL 32.768kHZ: Crystal 32.768kHz ±20ppm (Tol) 12.5pF Flexural 90000Ohm 2-Pin CSMD T/R; Manufacturer: Abracon; Designed by: FURKAN; ESR (Equivalent Series Resistance): 90kR; Supplier: Digikey; Supplier Part Number: 535-11899-1-ND; Manufacturer Part Number: ABS05-32.768KHZ-T; RoHS: Yes; Category: Crystals; Stock: 107347; Pricing: 1=0,66, 10=0,57, 50=0,517, 100=0,4956, 500=0,44932, 1000=0,43073, 3000=0,40284, 6000=0,38619, 9000=0,37678, 15000=0,36526, 21000=0,35786 (USD); Mounting Technology: Surface Mount; Case/Package: ABS05; Pins: 2; Min Operating Temperature: -40°C; Max Operating Temperature: 85°C; Packaging: Tape and Reel; Frequency Tolerance: 20ppm; Load Capacitance: 12.5pF; Package Quantity: 3000; Tolerance: 20ppm; Termination: SMD/SMT; ESR: 90kR; Series: ABS05; Operating Frequency: 32.768 kHz; Length: 1.6mm; Width: 1mm; Height: 0.5mm; Depth: 1mm; Radiation Hardening: No; Reach SVHC Compliant: No; Lead Free: Lead Free; RoHS Compliant: Yes; ComponentLink1URL: https://datasheet.ciiva.com/23810/abs05-23810480.pdf?src-supplier=Newark; ComponentLink1Description: https://datasheet.ciiva.com/23810/abs05-23810480.pdf?src-supplier=Newark; ComponentLink2URL: https://datasheet.ciiva.com/6728/abs05-6728949.pdf?src-supplier=Digikey; ComponentLink2Description: https://datasheet.ciiva.com/6728/abs05-6728949.pdf?src-supplier=Digikey; ComponentLink3URL: https://datasheet.ciiva.com/6728/abs05-6728950.pdf?src-supplier=Digikey; ComponentLink3Description: https://datasheet.ciiva.com/6728/abs05-6728950.pdf?src-supplier=Digikey; ComponentLink4URL: https://datasheet.ciiva.com/16411/abs05-16411149.pdf?src-supplier=Future+Electronics; ComponentLink4Description: https://datasheet.ciiva.com/16411/abs05-16411149.pdf?src-supplier=Future+Electronics